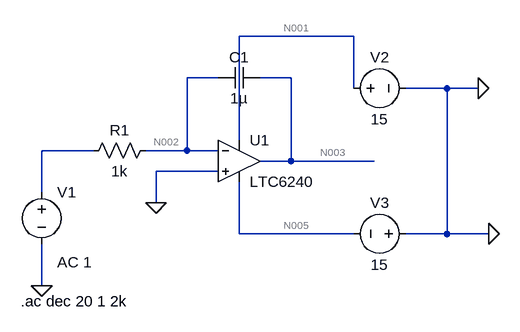
[diagram p0: schematic active filter.asc]
* active filter.asc
* U1: LTC6240 (symbol OpAmps\LTC6240 not available, pins judged from their places): In+=0 In-=N002 V+=N001 V-=N005 OUT=N003
R1 N002 N004 1k
V1 N004 0 AC 1
C1 N003 N002 1µ
V2 N001 0 15
V3 0 N005 15
.ac dec 20 1 2k
.backanno
.end

* Results of the author's LTspice run, read from the files saved beside the schematic
* Operating Point, zero values left out:
*   V(n003) = 636 mV
*   V(n005) = -15 V
*   V(n001) = 15 V
*   I(V2) = -7.021 mA
*   I(V3) = -7.021 mA
*   Ix(u1:3) = 7.021 mA
*   Ix(u1:4) = -7.021 mA
*   Ix(u1:5) = -1.272 pA
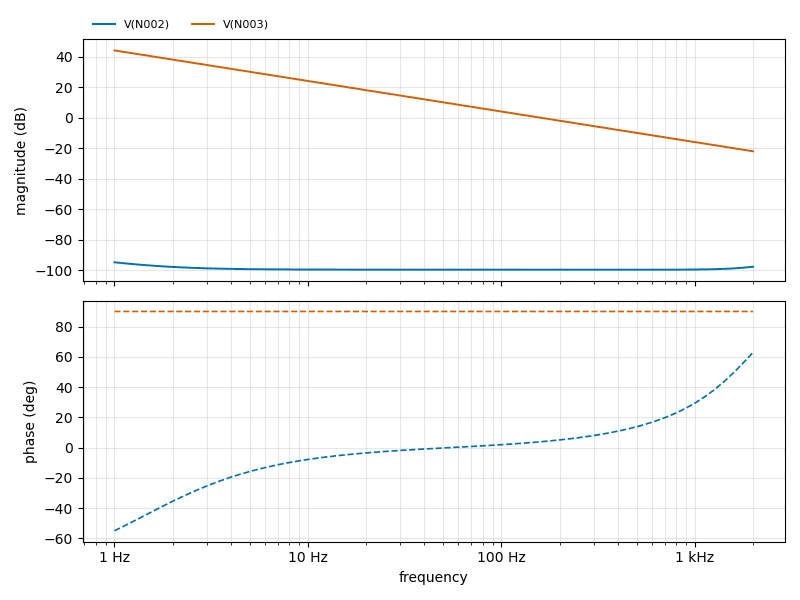
[diagram p1: AC Analysis of active filter.asc, plotted from the saved traces]
* AC Analysis, 1 run:
*   V(N002): -94.65 dB at 1 Hz, -97.57 dB at 2 kHz, peak -94.65 dB at 1 Hz, 3 dB below the peak at 1.979 Hz
*   V(N003): 44.04 dB at 1 Hz, -21.98 dB at 2 kHz, peak 44.04 dB at 1 Hz, 3 dB below the peak at 1.414 Hz